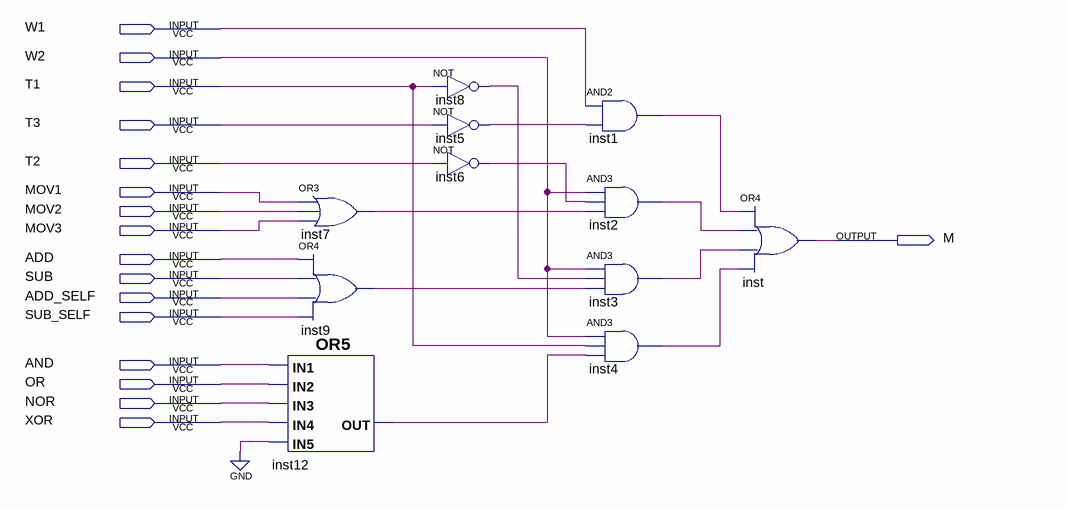
[diagram p0: schematic sheet]
// Quartus schematic M.bdf as structural Verilog: 11 symbols, 17 pins
module M (
  input  W1,
  input  W2,
  input  T1,
  input  T3,
  input  T2,
  input  MOV1,
  input  MOV2,
  input  MOV3,
  input  ADD,
  input  SUB,
  input  ADD_SELF,
  input  SUB_SELF,
  input  AND,
  input  OR,
  input  NOR,
  input  XOR,
  output M
);

  wire inst1_out, inst2_out, inst3_out, inst4_out, inst5_out, inst6_out, inst7_out, inst8_out, inst9_out,
       inst12_out;

  or inst7 (inst7_out, MOV1, MOV2, MOV3);
  or inst9 (inst9_out, ADD, SUB, ADD_SELF, SUB_SELF);
  or inst12 (inst12_out, AND, OR, NOR, XOR, 1'b0);
  not inst8 (inst8_out, T1);
  not inst5 (inst5_out, T3);
  not inst6 (inst6_out, T2);
  and inst1 (inst1_out, W1, inst5_out);
  and inst2 (inst2_out, W2, inst6_out, inst7_out);
  and inst3 (inst3_out, W2, inst8_out, inst9_out);
  and inst4 (inst4_out, W2, T1, inst12_out);
  or inst (M, inst1_out, inst2_out, inst3_out, inst4_out);
endmodule
